# EAGLE design main_schem (EAGLE 7.2.0)
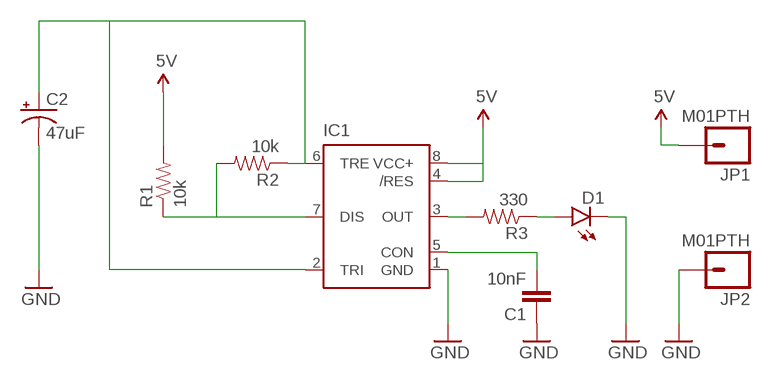
[diagram p0: schematic, sheet 1]

## Parts
C1  10nF  CAPPTH  [CAP-PTH-SMALL]
C2  47uF  CAP_POLPTH2  [CPOL-RADIAL-10UF-25V]
D1  LED5MM  [LED5MM]
IC1  NE555KIT  [DIP08-KIT]
JP1  M01PTH  [1X01]
JP2  M01PTH  [1X01]
R1  10k  10KOHM-1/4W5%(PTH)  [AXIAL-0.3]
R2  10k  10KOHM-1/4W5%(PTH)  [AXIAL-0.3]
R3  330  10KOHM-1/4W5%(PTH)  [AXIAL-0.3]

## Nets
5V: IC1.4(/RES) IC1.8(VCC+) JP1.1 R1.P$2
GND: C1.1 C2.2(-) D1.K(C) IC1.1(GND) JP2.1
N$1: C1.2 IC1.5(CON)
N$2: IC1.7(DIS) R1.P$1 R2.P$2
N$3: IC1.3(OUT) R3.P$2
N$4: C2.1(+) IC1.2(TRI) IC1.6(TRE) R2.P$1
N$5: D1.A R3.P$1

## Library data of the parts
C1 = SparkFun-Capacitors:CAP: Capacitor Standard 0603 ceramic capacitor, and 0.1" leaded capacitor.
C2 = SparkFun-Capacitors:CAP_POL: Capacitor Polarized These are standard SMD and PTH capacitors. Normally 10uF, 47uF, and 100uF in electrolytic and tantalum varieties. Always verify the external diameter of the through hole cap, it varies with capacity, voltage, and manufacturer. The EIA devices should be standard.
D1 = SparkFun-LED:LED: LEDs Standard schematic elements and footprints for 5mm, 3mm, 1206, and 0603 sized LEDs. 5mm - Spark Fun Electronics SKU : COM-00529 (and others)
IC1 = SparkFun-AnalogIC:NE555: General purpose bipolar Timer; PROD_ID: IC-11930
JP1 JP2 = SparkFun-Connectors:M01: Header 1 Standard 1-pin 0.1" header. Use with straight break away headers (SKU : PRT-00116), right angle break away headers (PRT-00553), swiss pins (PRT-00743), machine pins (PRT-00117), and female headers (PRT-00115).
R1 R2 = SparkFun-Resistors:10KOHM-1/4W5%(PTH): RES-09435; PROD_ID: RES-9435
R3 = SparkFun-Resistors:10KOHM-1/4W5%(PTH): RES-09435; PROD_ID: RES-9435; VALUE: 10k

## Board
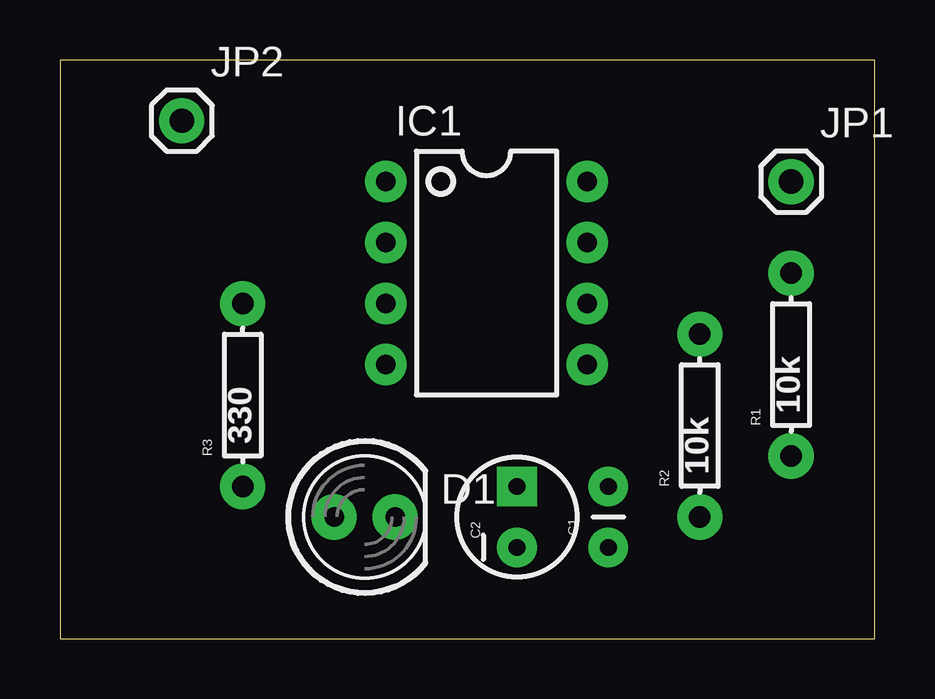
[diagram p1: board, top side]
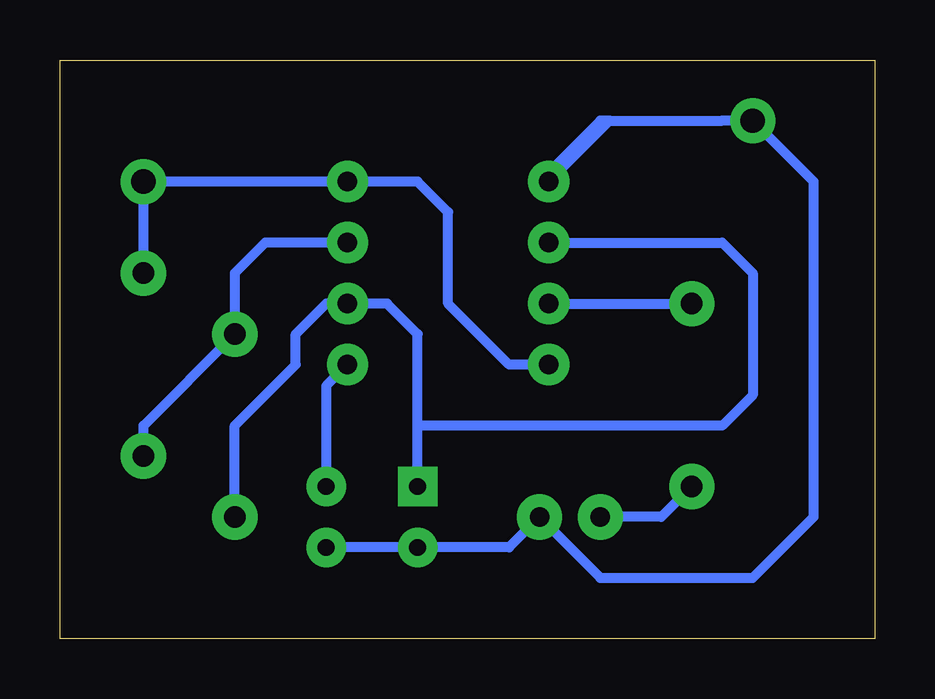
[diagram p2: board, bottom side, seen from below]

Size 33.96 x 24.12 mm. Coordinates in mm from the lower left corner, seen from the top.
Outline: 0,0 33.96,0 33.96,24.12 0,24.12 0,0
Copper layers (1*16): Top 0.035mm / dielectric 1.5mm / Bottom 0.035mm
Design rules "default": minimum track width 10mil, minimum drill 24mil, track to track 8mil, track to pad 8mil, pad to pad 8mil, via to via 8mil, smd to smd 8mil, copper to edge 40mil, drill to drill 8mil, minimum pad ring 10mil, minimum via ring 8mil, stop-mask expansion 4mil, vias tented up to drill 0mil, thermal gap 10mil

### Footprints (pad centres in the part's own frame; a part is rotated, then mirrored left to right if it is on the bottom)
CAP-PTH-SMALL = drill 0.7 pad 1.651: 1 0,0; 2 2.54,0
CPOL-RADIAL-10UF-25V = drill 0.7 pad 1.651 square: 1 1.27,0 | drill 0.7 pad 1.651: 2 -1.27,0
LED5MM = drill 0.813 pad 1.88: A -1.27,0; K 1.27,0
DIP08-KIT = drill 0.813 pad 1.727: 1 -3.81,-4.191; 2 -1.27,-4.191; 3 1.27,-4.191; 4 3.81,-4.191; 5 3.81,4.191; 6 1.27,4.191; 7 -1.27,4.191; 8 -3.81,4.191
1X01 = drill 1.016 pad 1.88: 1 0,0
AXIAL-0.3 = drill 0.9 pad 1.88: P$1 -3.81,0; P$2 3.81,0

### Placement (x,y rotation side)
C1  22.86,3.81 90 top
C2  19.05,5.08 90 top
D1  12.7,5.08 0 top
IC1  17.78,15.24 270 top
JP1  30.48,19.05 0 top
JP2  5.08,21.59 0 top
R1  30.48,11.43 90 top
R2  26.67,8.89 90 top
R3  7.62,10.16 90 top

### Tracks (layer width: path | path; a pad name or v marks a point on that pad's centre or on a via)
5V
  Bottom 0.406: R1.P$2 JP1.1 IC1.8 19.05,19.05 17.78,17.78 17.78,13.97 15.24,11.43 IC1.4
GND
  Bottom 0.406: 11.05,21.59 11.43,21.59 13.59,19.43 IC1.1 11.05,21.59 | C1.1 C2.2 15.24,3.81 D1.K 11.43,2.54 5.08,2.54 2.54,5.08 2.54,19.05 JP2.1 6.35,21.59 11.05,21.59
N$1
  Bottom 0.406: IC1.5 22.86,10.54 C1.2
N$2
  Bottom 0.406: IC1.7 25.4,16.51 26.67,15.24 R2.P$2 30.48,8.89 R1.P$1
N$3
  Bottom 0.406: IC1.3 R3.P$2
N$4
  Bottom 0.406: C2.1 19.05,8.89 | 19.05,8.89 19.05,12.7 20.32,13.97 IC1.6 22.86,13.97 24.13,12.7 24.13,11.43 26.67,8.89 R2.P$1 | IC1.2 6.35,16.51 5.08,15.24 5.08,10.16 6.35,8.89 19.05,8.89
N$5
  Bottom 0.406: R3.P$1 8.89,5.08 D1.A